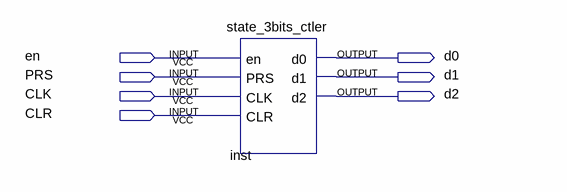
[diagram p0: schematic sheet]
// Quartus schematic test01.bdf as structural Verilog: 1 symbols, 7 pins
module test01 (
  input  en,
  input  PRS,
  input  CLK,
  input  CLR,
  output d0,
  output d1,
  output d2
);

  state_3bits_ctler inst (.en(en), .PRS(PRS), .CLK(CLK), .CLR(CLR), .d0(d0), .d1(d1), .d2(d2));
endmodule
